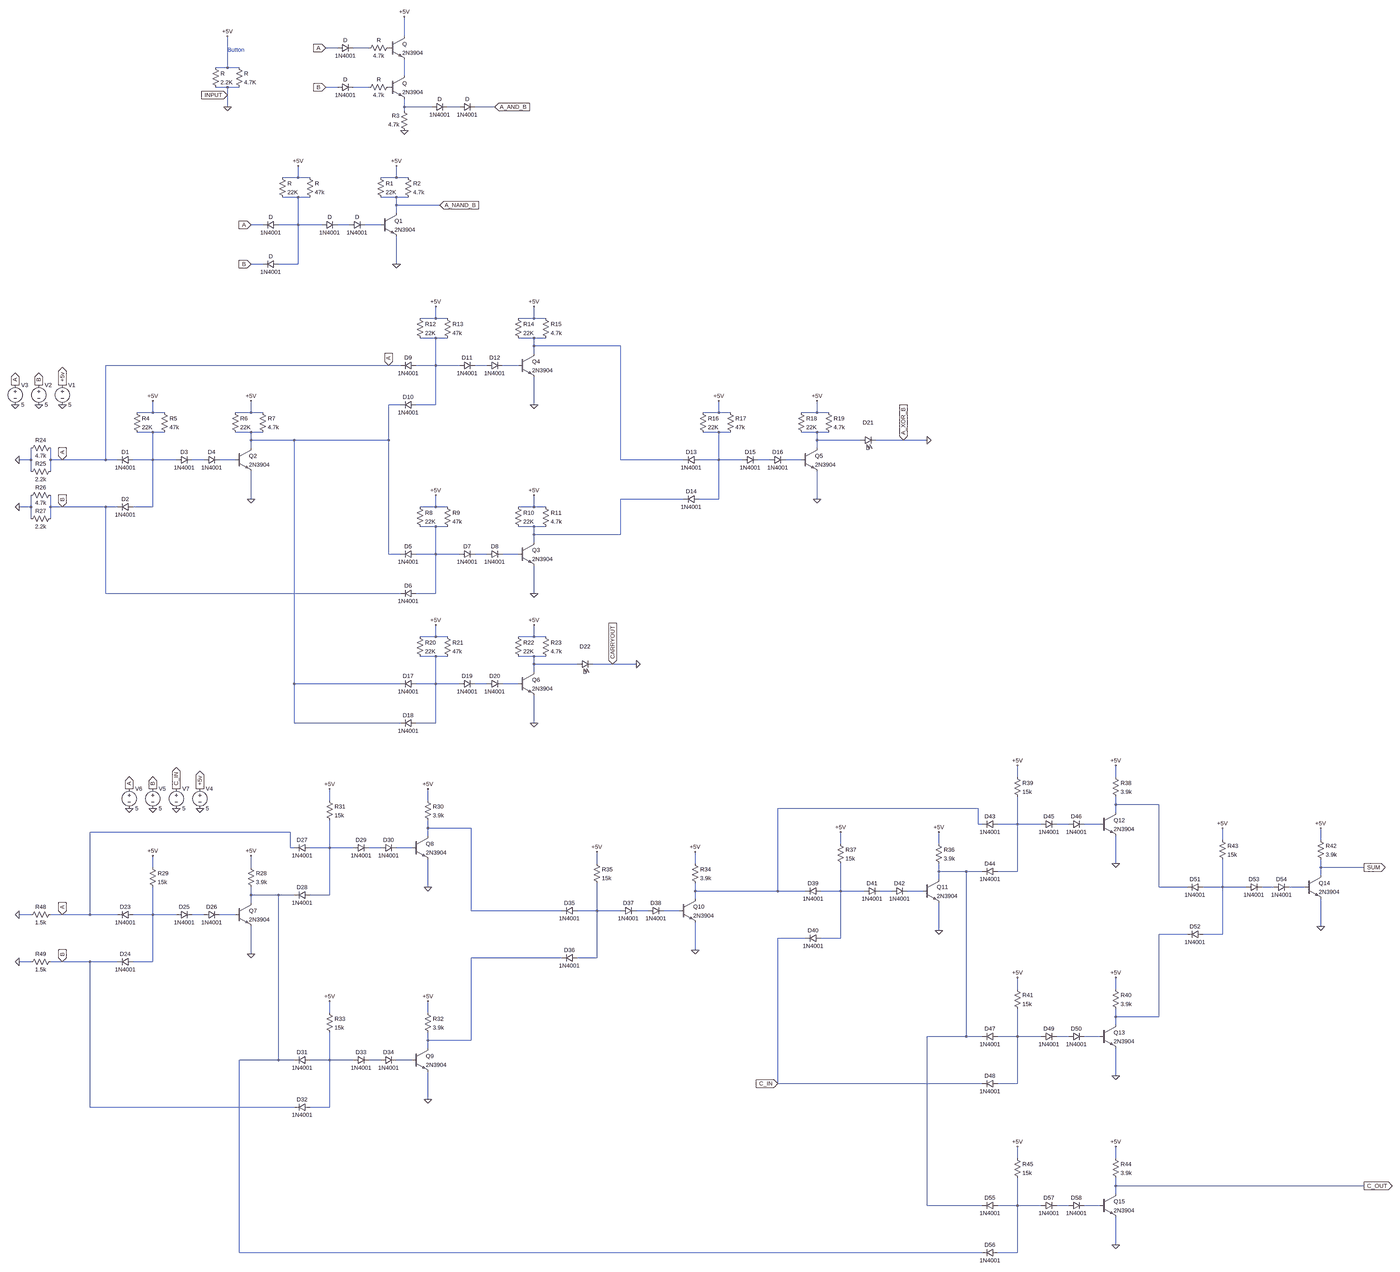
[diagram p0: schematic Project2SERRANO.asc, whole sheet]
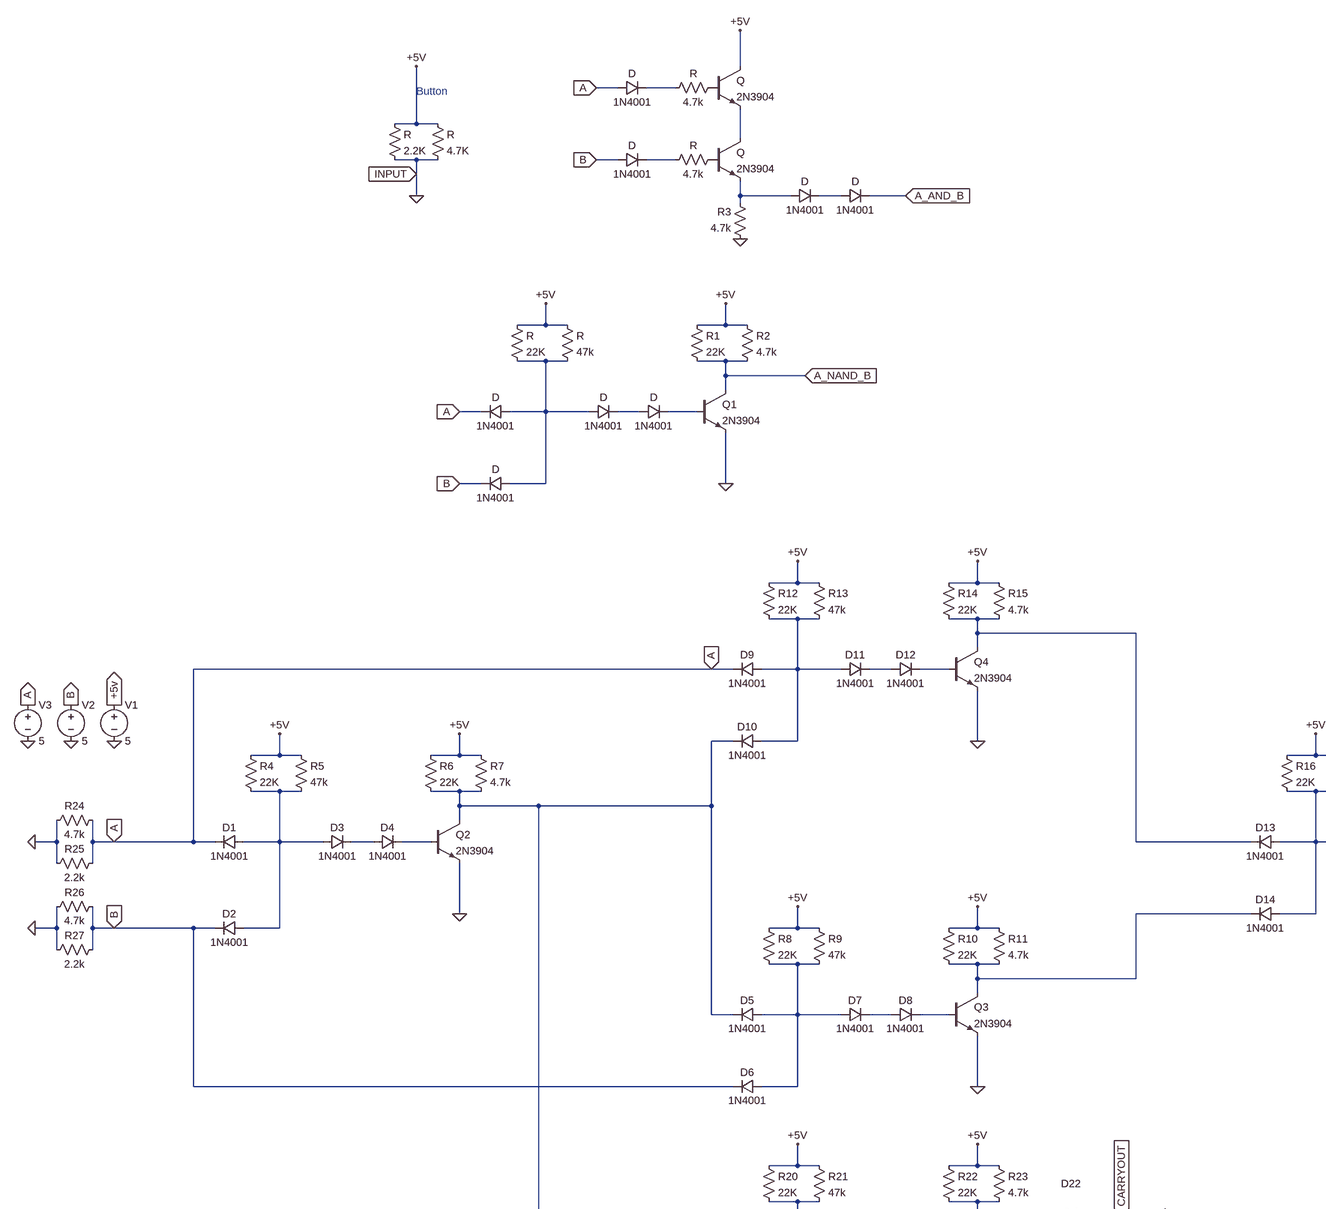
[diagram p1: schematic Project2SERRANO.asc, part, row 1 of 2, column 1 of 2]
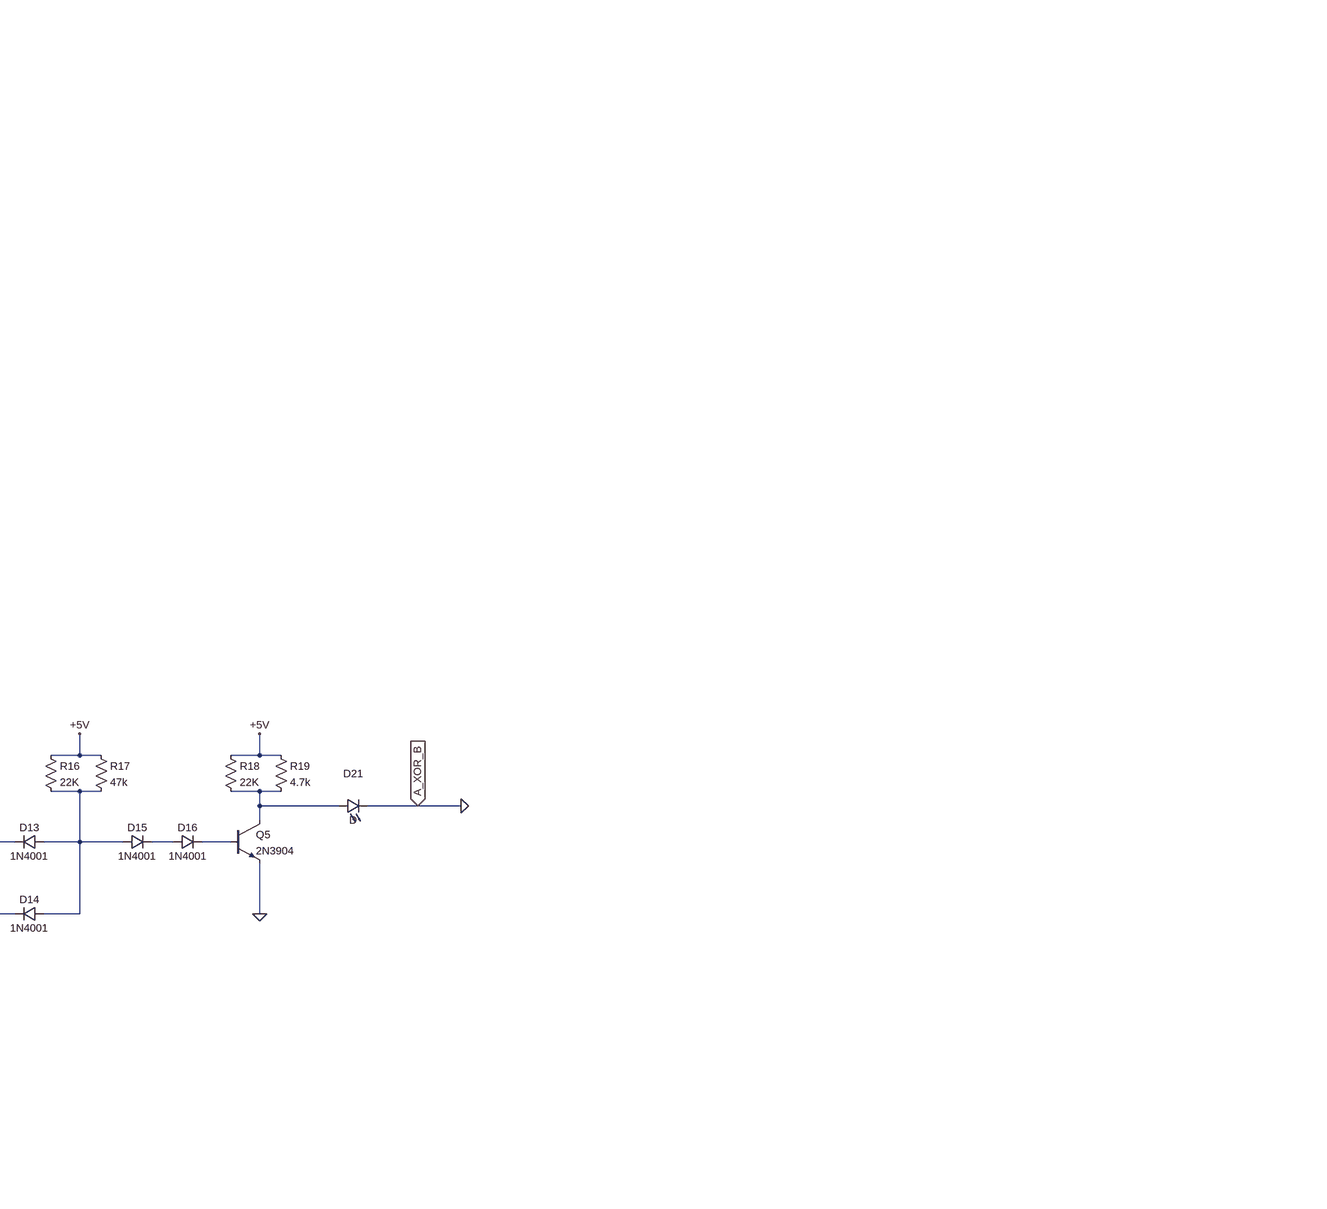
[diagram p2: schematic Project2SERRANO.asc, part, row 1 of 2, column 2 of 2]
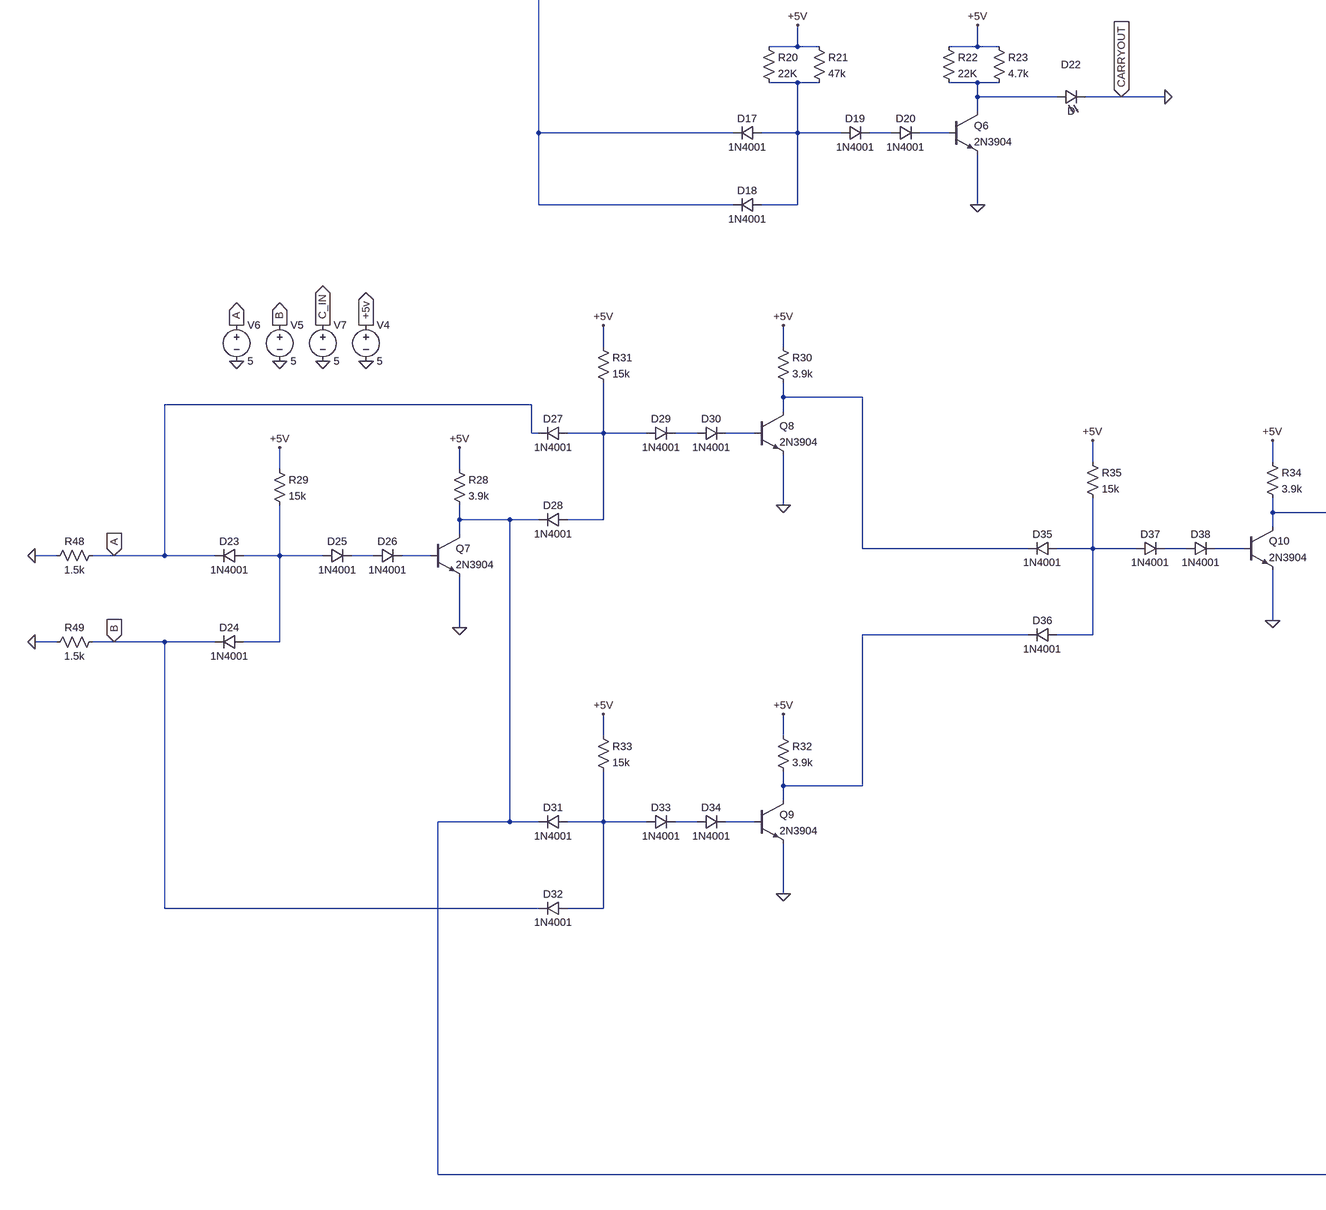
[diagram p3: schematic Project2SERRANO.asc, part, row 2 of 2, column 1 of 2]
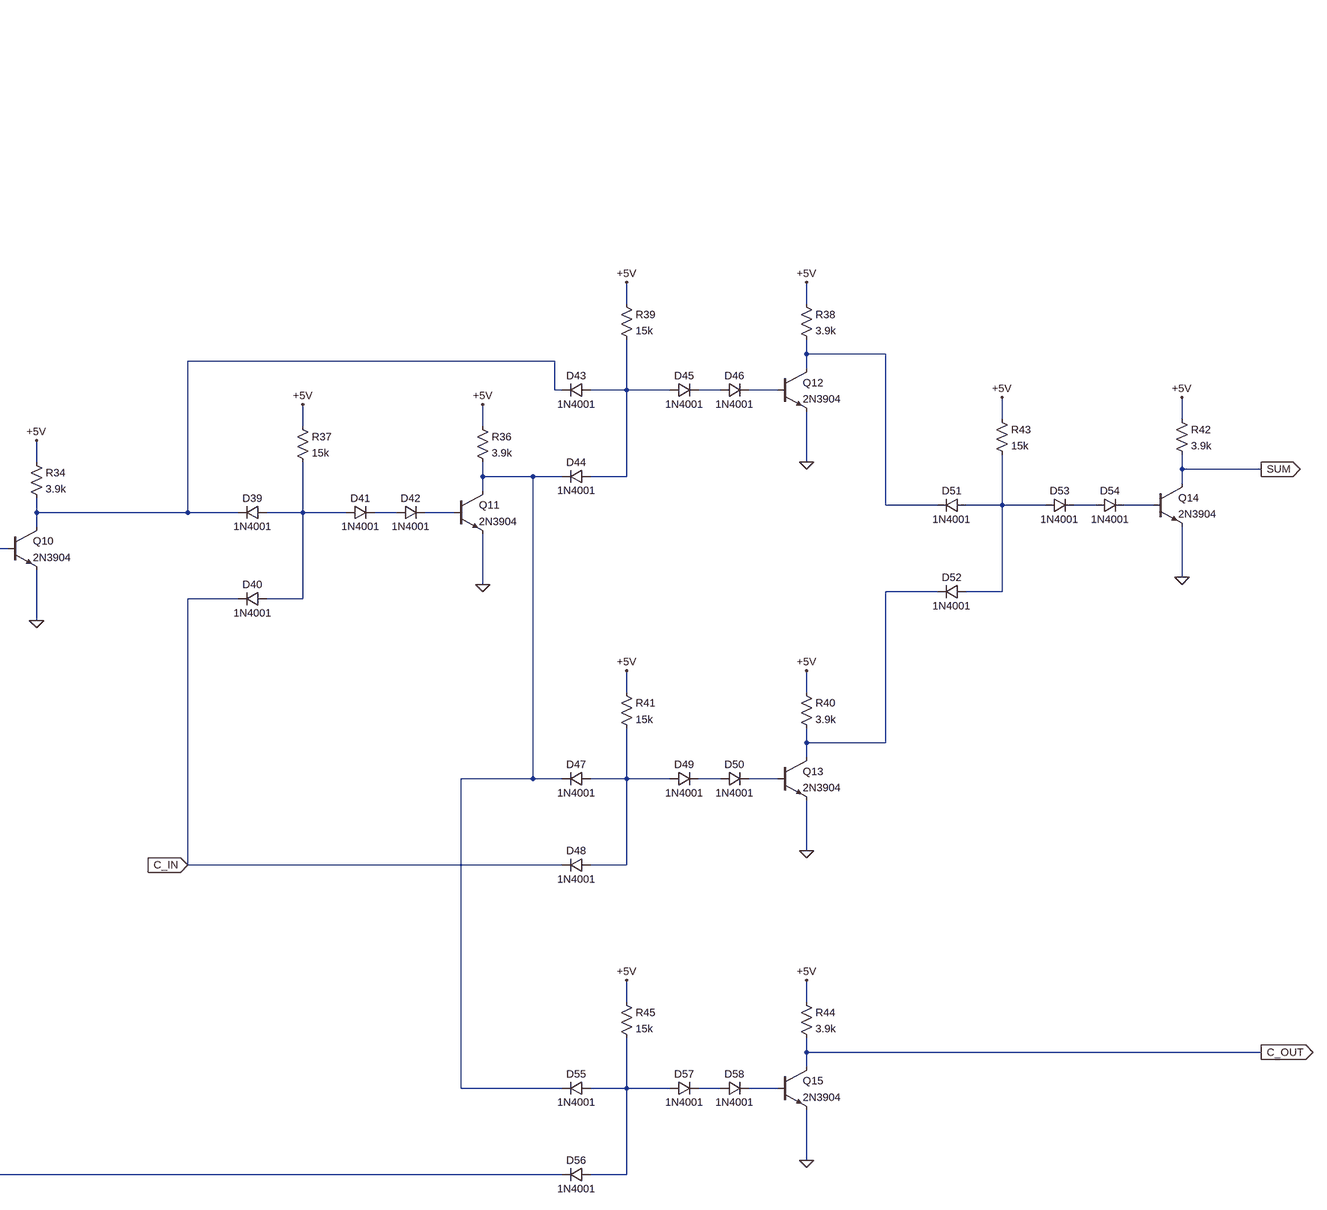
[diagram p4: schematic Project2SERRANO.asc, part, row 2 of 2, column 2 of 2]
Project2SERRANO.asc, the LTspice schematic file:
Version 4
SHEET 1 4668 5584
WIRE 368 -208 368 -288
WIRE 96 -160 48 -160
WIRE 224 -160 160 -160
WIRE -352 -80 -352 -208
WIRE -352 -80 -400 -80
WIRE -304 -80 -352 -80
WIRE 368 -48 368 -112
WIRE -352 0 -400 0
WIRE -304 0 -352 0
WIRE 96 0 48 0
WIRE 224 0 160 0
WIRE -352 32 -352 0
WIRE -352 80 -352 32
WIRE 368 80 368 48
WIRE 480 80 368 80
WIRE 592 80 544 80
WIRE 736 80 656 80
WIRE 368 96 368 80
WIRE -64 368 -64 320
WIRE -64 368 -128 368
WIRE -16 368 -64 368
WIRE 336 368 336 320
WIRE 336 368 272 368
WIRE 384 368 336 368
WIRE -64 448 -128 448
WIRE -16 448 -64 448
WIRE 336 448 272 448
WIRE 384 448 336 448
WIRE 336 480 336 448
WIRE 512 480 336 480
WIRE 336 512 336 480
WIRE -208 560 -256 560
WIRE -64 560 -64 448
WIRE -64 560 -144 560
WIRE 32 560 -64 560
WIRE 144 560 96 560
WIRE 272 560 208 560
WIRE -208 720 -256 720
WIRE -64 720 -64 560
WIRE -64 720 -144 720
WIRE 336 720 336 608
WIRE 496 1344 496 1296
WIRE 496 1344 432 1344
WIRE 544 1344 496 1344
WIRE 896 1344 896 1296
WIRE 896 1344 832 1344
WIRE 944 1344 896 1344
WIRE 496 1424 432 1424
WIRE 544 1424 496 1424
WIRE 896 1424 832 1424
WIRE 944 1424 896 1424
WIRE 896 1456 896 1424
WIRE 1248 1456 896 1456
WIRE 896 1488 896 1456
WIRE 304 1536 -848 1536
WIRE 352 1536 304 1536
WIRE 496 1536 496 1424
WIRE 496 1536 416 1536
WIRE 592 1536 496 1536
WIRE 704 1536 656 1536
WIRE 832 1536 768 1536
WIRE 352 1696 304 1696
WIRE 496 1696 496 1536
WIRE 496 1696 416 1696
WIRE 896 1696 896 1584
WIRE -656 1728 -656 1680
WIRE -656 1728 -720 1728
WIRE -608 1728 -656 1728
WIRE -256 1728 -256 1680
WIRE -256 1728 -320 1728
WIRE -208 1728 -256 1728
WIRE 1648 1728 1648 1680
WIRE 1648 1728 1584 1728
WIRE 1696 1728 1648 1728
WIRE 2048 1728 2048 1680
WIRE 2048 1728 1984 1728
WIRE 2096 1728 2048 1728
WIRE -656 1808 -720 1808
WIRE -608 1808 -656 1808
WIRE -256 1808 -320 1808
WIRE -208 1808 -256 1808
WIRE 1648 1808 1584 1808
WIRE 1696 1808 1648 1808
WIRE 2048 1808 1984 1808
WIRE 2096 1808 2048 1808
WIRE -256 1840 -256 1808
WIRE -80 1840 -256 1840
WIRE 304 1840 304 1696
WIRE 304 1840 -80 1840
WIRE 2048 1840 2048 1808
WIRE 2224 1840 2048 1840
WIRE 2400 1840 2288 1840
WIRE 2496 1840 2400 1840
WIRE -256 1872 -256 1840
WIRE 2048 1872 2048 1840
WIRE -1152 1920 -1152 1872
WIRE -1152 1920 -1200 1920
WIRE -1072 1920 -1072 1872
WIRE -1024 1920 -1072 1920
WIRE -848 1920 -848 1536
WIRE -848 1920 -1024 1920
WIRE -800 1920 -848 1920
WIRE -656 1920 -656 1808
WIRE -656 1920 -736 1920
WIRE -560 1920 -656 1920
WIRE -448 1920 -496 1920
WIRE -320 1920 -384 1920
WIRE 1248 1920 1248 1456
WIRE 1504 1920 1248 1920
WIRE 1648 1920 1648 1808
WIRE 1648 1920 1568 1920
WIRE 1744 1920 1648 1920
WIRE 1856 1920 1808 1920
WIRE 1984 1920 1920 1920
WIRE -1152 1968 -1152 1920
WIRE -1072 1968 -1072 1920
WIRE -256 2080 -256 1968
WIRE 1504 2080 1248 2080
WIRE 1648 2080 1648 1920
WIRE 1648 2080 1568 2080
WIRE 2048 2080 2048 1968
WIRE -1152 2112 -1152 2064
WIRE -1152 2112 -1200 2112
WIRE -1072 2112 -1072 2064
WIRE -1024 2112 -1072 2112
WIRE -848 2112 -1024 2112
WIRE -800 2112 -848 2112
WIRE -656 2112 -656 1920
WIRE -656 2112 -736 2112
WIRE 496 2112 496 2064
WIRE 496 2112 432 2112
WIRE 544 2112 496 2112
WIRE 896 2112 896 2064
WIRE 896 2112 832 2112
WIRE 944 2112 896 2112
WIRE -1152 2160 -1152 2112
WIRE -1072 2160 -1072 2112
WIRE 496 2192 432 2192
WIRE 544 2192 496 2192
WIRE 896 2192 832 2192
WIRE 944 2192 896 2192
WIRE 896 2224 896 2192
WIRE 1248 2224 1248 2080
WIRE 1248 2224 896 2224
WIRE 896 2256 896 2224
WIRE 304 2304 304 1840
WIRE 352 2304 304 2304
WIRE 496 2304 496 2192
WIRE 496 2304 416 2304
WIRE 592 2304 496 2304
WIRE 704 2304 656 2304
WIRE 832 2304 768 2304
WIRE -848 2464 -848 2112
WIRE 352 2464 -848 2464
WIRE 496 2464 496 2304
WIRE 496 2464 416 2464
WIRE 896 2464 896 2352
WIRE 496 2640 496 2592
WIRE 496 2640 432 2640
WIRE 544 2640 496 2640
WIRE 896 2640 896 2592
WIRE 896 2640 832 2640
WIRE 944 2640 896 2640
WIRE 496 2720 432 2720
WIRE 544 2720 496 2720
WIRE 896 2720 832 2720
WIRE 944 2720 896 2720
WIRE 896 2752 896 2720
WIRE 1072 2752 896 2752
WIRE 1216 2752 1136 2752
WIRE 1312 2752 1216 2752
WIRE 896 2784 896 2752
WIRE -80 2832 -80 1840
WIRE 352 2832 -80 2832
WIRE 496 2832 496 2720
WIRE 496 2832 416 2832
WIRE 592 2832 496 2832
WIRE 704 2832 656 2832
WIRE 832 2832 768 2832
WIRE -80 2992 -80 2832
WIRE 352 2992 -80 2992
WIRE 496 2992 496 2832
WIRE 496 2992 416 2992
WIRE 896 2992 896 2880
WIRE 2864 3600 2864 3552
WIRE 3264 3600 3264 3552
WIRE 64 3696 64 3648
WIRE 464 3696 464 3648
WIRE 3264 3712 3264 3680
WIRE 3440 3712 3264 3712
WIRE 2704 3728 1888 3728
WIRE 3264 3744 3264 3712
WIRE 2704 3792 2704 3728
WIRE 2720 3792 2704 3792
WIRE 2864 3792 2864 3680
WIRE 2864 3792 2784 3792
WIRE 2960 3792 2864 3792
WIRE 3072 3792 3024 3792
WIRE 3200 3792 3136 3792
WIRE 464 3808 464 3776
WIRE 640 3808 464 3808
WIRE -96 3824 -912 3824
WIRE 464 3840 464 3808
WIRE 3952 3856 3952 3808
WIRE 4352 3856 4352 3808
WIRE 2144 3872 2144 3824
WIRE 2544 3872 2544 3824
WIRE -96 3888 -96 3824
WIRE -80 3888 -96 3888
WIRE 64 3888 64 3776
WIRE 64 3888 -16 3888
WIRE 160 3888 64 3888
WIRE 272 3888 224 3888
WIRE 400 3888 336 3888
WIRE 1152 3952 1152 3904
WIRE 1552 3952 1552 3904
WIRE 3264 3952 3264 3840
WIRE -656 3968 -656 3920
WIRE -256 3968 -256 3920
WIRE 4352 3968 4352 3936
WIRE 4528 3968 4352 3968
WIRE 2544 3984 2544 3952
WIRE 2656 3984 2544 3984
WIRE 2720 3984 2656 3984
WIRE 2864 3984 2864 3792
WIRE 2864 3984 2784 3984
WIRE 4352 4000 4352 3968
WIRE 2544 4016 2544 3984
WIRE 464 4048 464 3936
WIRE 3440 4048 3440 3712
WIRE 3808 4048 3440 4048
WIRE 3952 4048 3952 3936
WIRE 3952 4048 3872 4048
WIRE 4048 4048 3952 4048
WIRE 4160 4048 4112 4048
WIRE 4288 4048 4224 4048
WIRE 1552 4064 1552 4032
WIRE 1888 4064 1888 3728
WIRE 1888 4064 1552 4064
WIRE 2000 4064 1888 4064
WIRE 2144 4064 2144 3952
WIRE 2144 4064 2064 4064
WIRE 2240 4064 2144 4064
WIRE 2352 4064 2304 4064
WIRE 2480 4064 2416 4064
WIRE -256 4080 -256 4048
WIRE -144 4080 -256 4080
WIRE -80 4080 -144 4080
WIRE 64 4080 64 3888
WIRE 64 4080 -16 4080
WIRE 1552 4096 1552 4064
WIRE -256 4112 -256 4080
WIRE 640 4144 640 3808
WIRE 1008 4144 640 4144
WIRE 1152 4144 1152 4032
WIRE 1152 4144 1072 4144
WIRE 1248 4144 1152 4144
WIRE 1360 4144 1312 4144
WIRE 1488 4144 1424 4144
WIRE -1152 4160 -1200 4160
WIRE -1024 4160 -1072 4160
WIRE -912 4160 -912 3824
WIRE -912 4160 -1024 4160
WIRE -800 4160 -912 4160
WIRE -656 4160 -656 4048
WIRE -656 4160 -736 4160
WIRE -560 4160 -656 4160
WIRE -448 4160 -496 4160
WIRE -320 4160 -384 4160
WIRE 4352 4208 4352 4096
WIRE 2544 4224 2544 4112
WIRE 3808 4240 3440 4240
WIRE 3952 4240 3952 4048
WIRE 3952 4240 3872 4240
WIRE 2000 4256 1888 4256
WIRE 2144 4256 2144 4064
WIRE 2144 4256 2064 4256
WIRE 1552 4304 1552 4192
WIRE -256 4320 -256 4208
WIRE 1008 4336 640 4336
WIRE 1152 4336 1152 4144
WIRE 1152 4336 1072 4336
WIRE -1152 4352 -1200 4352
WIRE -1024 4352 -1072 4352
WIRE -912 4352 -1024 4352
WIRE -800 4352 -912 4352
WIRE -656 4352 -656 4160
WIRE -656 4352 -736 4352
WIRE 2864 4464 2864 4416
WIRE 3264 4464 3264 4416
WIRE 64 4560 64 4512
WIRE 464 4560 464 4512
WIRE 3264 4576 3264 4544
WIRE 3440 4576 3440 4240
WIRE 3440 4576 3264 4576
WIRE 3264 4608 3264 4576
WIRE 2656 4656 2656 3984
WIRE 2656 4656 2496 4656
WIRE 2720 4656 2656 4656
WIRE 2864 4656 2864 4544
WIRE 2864 4656 2784 4656
WIRE 2960 4656 2864 4656
WIRE 3072 4656 3024 4656
WIRE 3200 4656 3136 4656
WIRE 464 4672 464 4640
WIRE 640 4672 640 4336
WIRE 640 4672 464 4672
WIRE 464 4704 464 4672
WIRE -144 4752 -144 4080
WIRE -144 4752 -304 4752
WIRE -80 4752 -144 4752
WIRE 64 4752 64 4640
WIRE 64 4752 -16 4752
WIRE 160 4752 64 4752
WIRE 272 4752 224 4752
WIRE 400 4752 336 4752
WIRE 3264 4816 3264 4704
WIRE 1888 4848 1888 4256
WIRE 2720 4848 1888 4848
WIRE 2864 4848 2864 4656
WIRE 2864 4848 2784 4848
WIRE 464 4912 464 4800
WIRE -912 4944 -912 4352
WIRE -80 4944 -912 4944
WIRE 64 4944 64 4752
WIRE 64 4944 -16 4944
WIRE 2864 5152 2864 5104
WIRE 3264 5152 3264 5104
WIRE 3264 5264 3264 5232
WIRE 4528 5264 3264 5264
WIRE 3264 5296 3264 5264
WIRE 2496 5344 2496 4656
WIRE 2720 5344 2496 5344
WIRE 2864 5344 2864 5232
WIRE 2864 5344 2784 5344
WIRE 2960 5344 2864 5344
WIRE 3072 5344 3024 5344
WIRE 3200 5344 3136 5344
WIRE 3264 5504 3264 5392
WIRE -304 5536 -304 4752
WIRE 2720 5536 -304 5536
WIRE 2864 5536 2864 5344
WIRE 2864 5536 2784 5536
FLAG 48 0 B
IOPIN 48 0 In
FLAG 48 -160 A
IOPIN 48 -160 In
FLAG 736 80 A_AND_B
IOPIN 736 80 In
FLAG 368 -288 +5V
FLAG 368 176 0
FLAG -352 -208 +5V
FLAG -352 80 0
FLAG -352 32 INPUT
IOPIN -352 32 In
FLAG -256 720 B
IOPIN -256 720 In
FLAG -256 560 A
IOPIN -256 560 In
FLAG -64 320 +5V
FLAG 336 320 +5V
FLAG 336 720 0
FLAG 512 480 A_NAND_B
IOPIN 512 480 In
FLAG -656 1680 +5V
FLAG -256 1680 +5V
FLAG -256 2080 0
FLAG 496 2064 +5V
FLAG 896 2064 +5V
FLAG 896 2464 0
FLAG 304 1536 A
IOPIN 304 1536 In
FLAG 496 1296 +5V
FLAG 896 1296 +5V
FLAG 896 1696 0
FLAG 1648 1680 +5V
FLAG 2048 1680 +5V
FLAG 2048 2080 0
FLAG 2400 1840 A_XOR_B
IOPIN 2400 1840 In
FLAG 496 2592 +5V
FLAG 896 2592 +5V
FLAG 896 2992 0
FLAG 1216 2752 CARRYOUT
IOPIN 1216 2752 In
FLAG 2496 1840 0
FLAG 1312 2752 0
FLAG -1024 1920 A
IOPIN -1024 1920 In
FLAG -1024 2112 B
IOPIN -1024 2112 In
FLAG -1200 1920 0
FLAG -1200 2112 0
FLAG -1024 1696 0
FLAG -1024 1616 +5v
IOPIN -1024 1616 Out
FLAG -1120 1696 0
FLAG -1120 1616 B
IOPIN -1120 1616 Out
FLAG -1216 1696 0
FLAG -1216 1616 A
IOPIN -1216 1616 Out
FLAG -656 3920 +5V
FLAG -256 3920 +5V
FLAG -256 4320 0
FLAG -1024 4160 A
IOPIN -1024 4160 In
FLAG -1024 4352 B
IOPIN -1024 4352 In
FLAG -1200 4160 0
FLAG -1200 4352 0
FLAG -464 3728 0
FLAG -464 3648 +5v
IOPIN -464 3648 Out
FLAG -656 3728 0
FLAG -656 3648 B
IOPIN -656 3648 Out
FLAG -752 3728 0
FLAG -752 3648 A
IOPIN -752 3648 Out
FLAG 64 3648 +5V
FLAG 464 3648 +5V
FLAG 464 4048 0
FLAG 64 4512 +5V
FLAG 464 4512 +5V
FLAG 464 4912 0
FLAG 1152 3904 +5V
FLAG 1552 3904 +5V
FLAG 1552 4304 0
FLAG 2144 3824 +5V
FLAG 2544 3824 +5V
FLAG 2544 4224 0
FLAG 2864 3552 +5V
FLAG 3264 3552 +5V
FLAG 3264 3952 0
FLAG 2864 4416 +5V
FLAG 3264 4416 +5V
FLAG 3264 4816 0
FLAG 3952 3808 +5V
FLAG 4352 3808 +5V
FLAG 4352 4208 0
FLAG 1888 4848 C_IN
IOPIN 1888 4848 In
FLAG 4528 3968 SUM
IOPIN 4528 3968 Out
FLAG 2864 5104 +5V
FLAG 3264 5104 +5V
FLAG 3264 5504 0
FLAG 4528 5264 C_OUT
IOPIN 4528 5264 Out
FLAG -560 3728 0
FLAG -560 3648 C_IN
IOPIN -560 3648 Out
SYMBOL diode 96 -144 R270
WINDOW 0 32 32 VTop 2
WINDOW 3 0 32 VBottom 2
SYMATTR InstName D
SYMATTR Value 1N4001
SYMBOL diode 96 16 R270
WINDOW 0 32 32 VTop 2
WINDOW 3 0 32 VBottom 2
SYMATTR InstName D
SYMATTR Value 1N4001
SYMBOL npn 304 -208 R0
SYMATTR InstName Q
SYMATTR Value 2N3904
SYMBOL res 208 16 R270
WINDOW 0 32 56 VTop 2
WINDOW 3 0 56 VBottom 2
SYMATTR InstName R
SYMATTR Value 4.7k
SYMBOL res 208 -144 R270
WINDOW 0 32 56 VTop 2
WINDOW 3 0 56 VBottom 2
SYMATTR InstName R
SYMATTR Value 4.7k
SYMBOL npn 304 -48 R0
SYMATTR InstName Q
SYMATTR Value 2N3904
SYMBOL res 384 192 R180
WINDOW 0 36 76 Left 2
WINDOW 3 36 40 Left 2
SYMATTR InstName R3
SYMATTR Value 4.7k
SYMBOL diode 480 96 R270
WINDOW 0 32 32 VTop 2
WINDOW 3 0 32 VBottom 2
SYMATTR InstName D
SYMATTR Value 1N4001
SYMBOL diode 592 96 R270
WINDOW 0 32 32 VTop 2
WINDOW 3 0 32 VBottom 2
SYMATTR InstName D
SYMATTR Value 1N4001
SYMBOL res -320 -96 R0
SYMATTR InstName R
SYMATTR Value 4.7K
SYMBOL res -416 -96 R0
SYMATTR InstName R
SYMATTR Value 2.2K
SYMBOL diode -144 544 R90
WINDOW 0 0 32 VBottom 2
WINDOW 3 32 32 VTop 2
SYMATTR InstName D
SYMATTR Value 1N4001
SYMBOL diode -144 704 R90
WINDOW 0 0 32 VBottom 2
WINDOW 3 32 32 VTop 2
SYMATTR InstName D
SYMATTR Value 1N4001
SYMBOL res -144 352 R0
SYMATTR InstName R
SYMATTR Value 22K
SYMBOL res -32 352 R0
SYMATTR InstName R
SYMATTR Value 47k
SYMBOL diode 32 576 R270
WINDOW 0 32 32 VTop 2
WINDOW 3 0 32 VBottom 2
SYMATTR InstName D
SYMATTR Value 1N4001
SYMBOL diode 144 576 R270
WINDOW 0 32 32 VTop 2
WINDOW 3 0 32 VBottom 2
SYMATTR InstName D
SYMATTR Value 1N4001
SYMBOL npn 272 512 R0
SYMATTR InstName Q1
SYMATTR Value 2N3904
SYMBOL res 256 352 R0
SYMATTR InstName R1
SYMATTR Value 22K
SYMBOL res 368 352 R0
SYMATTR InstName R2
SYMATTR Value 4.7k
SYMBOL diode -736 1904 R90
WINDOW 0 0 32 VBottom 2
WINDOW 3 32 32 VTop 2
SYMATTR InstName D1
SYMATTR Value 1N4001
SYMBOL diode -736 2096 R90
WINDOW 0 0 32 VBottom 2
WINDOW 3 32 32 VTop 2
SYMATTR InstName D2
SYMATTR Value 1N4001
SYMBOL res -736 1712 R0
SYMATTR InstName R4
SYMATTR Value 22K
SYMBOL res -624 1712 R0
SYMATTR InstName R5
SYMATTR Value 47k
SYMBOL diode -560 1936 R270
WINDOW 0 32 32 VTop 2
WINDOW 3 0 32 VBottom 2
SYMATTR InstName D3
SYMATTR Value 1N4001
SYMBOL diode -448 1936 R270
WINDOW 0 32 32 VTop 2
WINDOW 3 0 32 VBottom 2
SYMATTR InstName D4
SYMATTR Value 1N4001
SYMBOL npn -320 1872 R0
SYMATTR InstName Q2
SYMATTR Value 2N3904
SYMBOL res -336 1712 R0
SYMATTR InstName R6
SYMATTR Value 22K
SYMBOL res -224 1712 R0
SYMATTR InstName R7
SYMATTR Value 4.7k
SYMBOL diode 416 2288 R90
WINDOW 0 0 32 VBottom 2
WINDOW 3 32 32 VTop 2
SYMATTR InstName D5
SYMATTR Value 1N4001
SYMBOL diode 416 2448 R90
WINDOW 0 0 32 VBottom 2
WINDOW 3 32 32 VTop 2
SYMATTR InstName D6
SYMATTR Value 1N4001
SYMBOL res 416 2096 R0
SYMATTR InstName R8
SYMATTR Value 22K
SYMBOL res 528 2096 R0
SYMATTR InstName R9
SYMATTR Value 47k
SYMBOL diode 592 2320 R270
WINDOW 0 32 32 VTop 2
WINDOW 3 0 32 VBottom 2
SYMATTR InstName D7
SYMATTR Value 1N4001
SYMBOL diode 704 2320 R270
WINDOW 0 32 32 VTop 2
WINDOW 3 0 32 VBottom 2
SYMATTR InstName D8
SYMATTR Value 1N4001
SYMBOL npn 832 2256 R0
SYMATTR InstName Q3
SYMATTR Value 2N3904
SYMBOL res 816 2096 R0
SYMATTR InstName R10
SYMATTR Value 22K
SYMBOL res 928 2096 R0
SYMATTR InstName R11
SYMATTR Value 4.7k
SYMBOL diode 416 1520 R90
WINDOW 0 0 32 VBottom 2
WINDOW 3 32 32 VTop 2
SYMATTR InstName D9
SYMATTR Value 1N4001
SYMBOL diode 416 1680 R90
WINDOW 0 0 32 VBottom 2
WINDOW 3 32 32 VTop 2
SYMATTR InstName D10
SYMATTR Value 1N4001
SYMBOL res 416 1328 R0
SYMATTR InstName R12
SYMATTR Value 22K
SYMBOL res 528 1328 R0
SYMATTR InstName R13
SYMATTR Value 47k
SYMBOL diode 592 1552 R270
WINDOW 0 32 32 VTop 2
WINDOW 3 0 32 VBottom 2
SYMATTR InstName D11
SYMATTR Value 1N4001
SYMBOL diode 704 1552 R270
WINDOW 0 32 32 VTop 2
WINDOW 3 0 32 VBottom 2
SYMATTR InstName D12
SYMATTR Value 1N4001
SYMBOL npn 832 1488 R0
SYMATTR InstName Q4
SYMATTR Value 2N3904
SYMBOL res 816 1328 R0
SYMATTR InstName R14
SYMATTR Value 22K
SYMBOL res 928 1328 R0
SYMATTR InstName R15
SYMATTR Value 4.7k
SYMBOL diode 1568 1904 R90
WINDOW 0 0 32 VBottom 2
WINDOW 3 32 32 VTop 2
SYMATTR InstName D13
SYMATTR Value 1N4001
SYMBOL diode 1568 2064 R90
WINDOW 0 0 32 VBottom 2
WINDOW 3 32 32 VTop 2
SYMATTR InstName D14
SYMATTR Value 1N4001
SYMBOL res 1568 1712 R0
SYMATTR InstName R16
SYMATTR Value 22K
SYMBOL res 1680 1712 R0
SYMATTR InstName R17
SYMATTR Value 47k
SYMBOL diode 1744 1936 R270
WINDOW 0 32 32 VTop 2
WINDOW 3 0 32 VBottom 2
SYMATTR InstName D15
SYMATTR Value 1N4001
SYMBOL diode 1856 1936 R270
WINDOW 0 32 32 VTop 2
WINDOW 3 0 32 VBottom 2
SYMATTR InstName D16
SYMATTR Value 1N4001
SYMBOL npn 1984 1872 R0
SYMATTR InstName Q5
SYMATTR Value 2N3904
SYMBOL res 1968 1712 R0
SYMATTR InstName R18
SYMATTR Value 22K
SYMBOL res 2080 1712 R0
SYMATTR InstName R19
SYMATTR Value 4.7k
SYMBOL diode 416 2816 R90
WINDOW 0 0 32 VBottom 2
WINDOW 3 32 32 VTop 2
SYMATTR InstName D17
SYMATTR Value 1N4001
SYMBOL diode 416 2976 R90
WINDOW 0 0 32 VBottom 2
WINDOW 3 32 32 VTop 2
SYMATTR InstName D18
SYMATTR Value 1N4001
SYMBOL res 416 2624 R0
SYMATTR InstName R20
SYMATTR Value 22K
SYMBOL res 528 2624 R0
SYMATTR InstName R21
SYMATTR Value 47k
SYMBOL diode 592 2848 R270
WINDOW 0 32 32 VTop 2
WINDOW 3 0 32 VBottom 2
SYMATTR InstName D19
SYMATTR Value 1N4001
SYMBOL diode 704 2848 R270
WINDOW 0 32 32 VTop 2
WINDOW 3 0 32 VBottom 2
SYMATTR InstName D20
SYMATTR Value 1N4001
SYMBOL npn 832 2784 R0
SYMATTR InstName Q6
SYMATTR Value 2N3904
SYMBOL res 816 2624 R0
SYMATTR InstName R22
SYMATTR Value 22K
SYMBOL res 928 2624 R0
SYMATTR InstName R23
SYMATTR Value 4.7k
SYMBOL LED 2224 1856 R270
WINDOW 0 72 32 VTop 2
WINDOW 3 0 32 VBottom 2
SYMATTR InstName D21
SYMBOL LED 1072 2768 R270
WINDOW 0 72 32 VTop 2
WINDOW 3 0 32 VBottom 2
SYMATTR InstName D22
SYMBOL res -1056 1856 R90
WINDOW 0 0 56 VBottom 2
WINDOW 3 32 56 VTop 2
SYMATTR InstName R24
SYMATTR Value 4.7k
SYMBOL res -1056 1952 R90
WINDOW 0 0 56 VBottom 2
WINDOW 3 32 56 VTop 2
SYMATTR InstName R25
SYMATTR Value 2.2k
SYMBOL res -1056 2048 R90
WINDOW 0 0 56 VBottom 2
WINDOW 3 32 56 VTop 2
SYMATTR InstName R26
SYMATTR Value 4.7k
SYMBOL res -1056 2144 R90
WINDOW 0 0 56 VBottom 2
WINDOW 3 32 56 VTop 2
SYMATTR InstName R27
SYMATTR Value 2.2k
SYMBOL voltage -1024 1600 R0
WINDOW 123 0 0 Left 0
WINDOW 39 0 0 Left 0
SYMATTR InstName V1
SYMATTR Value 5
SYMBOL voltage -1120 1600 R0
WINDOW 123 0 0 Left 0
WINDOW 39 0 0 Left 0
SYMATTR InstName V2
SYMATTR Value 5
SYMBOL voltage -1216 1600 R0
WINDOW 123 0 0 Left 0
WINDOW 39 0 0 Left 0
SYMATTR InstName V3
SYMATTR Value 5
SYMBOL diode -736 4144 R90
WINDOW 0 0 32 VBottom 2
WINDOW 3 32 32 VTop 2
SYMATTR InstName D23
SYMATTR Value 1N4001
SYMBOL diode -736 4336 R90
WINDOW 0 0 32 VBottom 2
WINDOW 3 32 32 VTop 2
SYMATTR InstName D24
SYMATTR Value 1N4001
SYMBOL diode -560 4176 R270
WINDOW 0 32 32 VTop 2
WINDOW 3 0 32 VBottom 2
SYMATTR InstName D25
SYMATTR Value 1N4001
SYMBOL diode -448 4176 R270
WINDOW 0 32 32 VTop 2
WINDOW 3 0 32 VBottom 2
SYMATTR InstName D26
SYMATTR Value 1N4001
SYMBOL npn -320 4112 R0
SYMATTR InstName Q7
SYMATTR Value 2N3904
SYMBOL voltage -464 3632 R0
WINDOW 123 0 0 Left 0
WINDOW 39 0 0 Left 0
SYMATTR InstName V4
SYMATTR Value 5
SYMBOL voltage -656 3632 R0
WINDOW 123 0 0 Left 0
WINDOW 39 0 0 Left 0
SYMATTR InstName V5
SYMATTR Value 5
SYMBOL voltage -752 3632 R0
WINDOW 123 0 0 Left 0
WINDOW 39 0 0 Left 0
SYMATTR InstName V6
SYMATTR Value 5
SYMBOL res -1056 4144 R90
WINDOW 0 0 56 VBottom 2
WINDOW 3 32 56 VTop 2
SYMATTR InstName R48
SYMATTR Value 1.5k
SYMBOL res -1056 4336 R90
WINDOW 0 0 56 VBottom 2
WINDOW 3 32 56 VTop 2
SYMATTR InstName R49
SYMATTR Value 1.5k
SYMBOL res -272 3952 R0
SYMATTR InstName R28
SYMATTR Value 3.9k
SYMBOL res -672 3952 R0
SYMATTR InstName R29
SYMATTR Value 15k
SYMBOL diode -16 3872 R90
WINDOW 0 0 32 VBottom 2
WINDOW 3 32 32 VTop 2
SYMATTR InstName D27
SYMATTR Value 1N4001
SYMBOL diode -16 4064 R90
WINDOW 0 0 32 VBottom 2
WINDOW 3 32 32 VTop 2
SYMATTR InstName D28
SYMATTR Value 1N4001
SYMBOL diode 160 3904 R270
WINDOW 0 32 32 VTop 2
WINDOW 3 0 32 VBottom 2
SYMATTR InstName D29
SYMATTR Value 1N4001
SYMBOL diode 272 3904 R270
WINDOW 0 32 32 VTop 2
WINDOW 3 0 32 VBottom 2
SYMATTR InstName D30
SYMATTR Value 1N4001
SYMBOL npn 400 3840 R0
SYMATTR InstName Q8
SYMATTR Value 2N3904
SYMBOL res 448 3680 R0
SYMATTR InstName R30
SYMATTR Value 3.9k
SYMBOL res 48 3680 R0
SYMATTR InstName R31
SYMATTR Value 15k
SYMBOL diode -16 4736 R90
WINDOW 0 0 32 VBottom 2
WINDOW 3 32 32 VTop 2
SYMATTR InstName D31
SYMATTR Value 1N4001
SYMBOL diode -16 4928 R90
WINDOW 0 0 32 VBottom 2
WINDOW 3 32 32 VTop 2
SYMATTR InstName D32
SYMATTR Value 1N4001
SYMBOL diode 160 4768 R270
WINDOW 0 32 32 VTop 2
WINDOW 3 0 32 VBottom 2
SYMATTR InstName D33
SYMATTR Value 1N4001
SYMBOL diode 272 4768 R270
WINDOW 0 32 32 VTop 2
WINDOW 3 0 32 VBottom 2
SYMATTR InstName D34
SYMATTR Value 1N4001
SYMBOL npn 400 4704 R0
SYMATTR InstName Q9
SYMATTR Value 2N3904
SYMBOL res 448 4544 R0
SYMATTR InstName R32
SYMATTR Value 3.9k
SYMBOL res 48 4544 R0
SYMATTR InstName R33
SYMATTR Value 15k
SYMBOL diode 1072 4128 R90
WINDOW 0 0 32 VBottom 2
WINDOW 3 32 32 VTop 2
SYMATTR InstName D35
SYMATTR Value 1N4001
SYMBOL diode 1072 4320 R90
WINDOW 0 0 32 VBottom 2
WINDOW 3 32 32 VTop 2
SYMATTR InstName D36
SYMATTR Value 1N4001
SYMBOL diode 1248 4160 R270
WINDOW 0 32 32 VTop 2
WINDOW 3 0 32 VBottom 2
SYMATTR InstName D37
SYMATTR Value 1N4001
SYMBOL diode 1360 4160 R270
WINDOW 0 32 32 VTop 2
WINDOW 3 0 32 VBottom 2
SYMATTR InstName D38
SYMATTR Value 1N4001
SYMBOL npn 1488 4096 R0
SYMATTR InstName Q10
SYMATTR Value 2N3904
SYMBOL res 1536 3936 R0
SYMATTR InstName R34
SYMATTR Value 3.9k
SYMBOL res 1136 3936 R0
SYMATTR InstName R35
SYMATTR Value 15k
SYMBOL diode 2064 4048 R90
WINDOW 0 0 32 VBottom 2
WINDOW 3 32 32 VTop 2
SYMATTR InstName D39
SYMATTR Value 1N4001
SYMBOL diode 2064 4240 R90
WINDOW 0 0 32 VBottom 2
WINDOW 3 32 32 VTop 2
SYMATTR InstName D40
SYMATTR Value 1N4001
SYMBOL diode 2240 4080 R270
WINDOW 0 32 32 VTop 2
WINDOW 3 0 32 VBottom 2
SYMATTR InstName D41
SYMATTR Value 1N4001
SYMBOL diode 2352 4080 R270
WINDOW 0 32 32 VTop 2
WINDOW 3 0 32 VBottom 2
SYMATTR InstName D42
SYMATTR Value 1N4001
SYMBOL npn 2480 4016 R0
SYMATTR InstName Q11
SYMATTR Value 2N3904
SYMBOL res 2528 3856 R0
SYMATTR InstName R36
SYMATTR Value 3.9k
SYMBOL res 2128 3856 R0
SYMATTR InstName R37
SYMATTR Value 15k
SYMBOL diode 2784 3776 R90
WINDOW 0 0 32 VBottom 2
WINDOW 3 32 32 VTop 2
SYMATTR InstName D43
SYMATTR Value 1N4001
SYMBOL diode 2784 3968 R90
WINDOW 0 0 32 VBottom 2
WINDOW 3 32 32 VTop 2
SYMATTR InstName D44
SYMATTR Value 1N4001
SYMBOL diode 2960 3808 R270
WINDOW 0 32 32 VTop 2
WINDOW 3 0 32 VBottom 2
SYMATTR InstName D45
SYMATTR Value 1N4001
SYMBOL diode 3072 3808 R270
WINDOW 0 32 32 VTop 2
WINDOW 3 0 32 VBottom 2
SYMATTR InstName D46
SYMATTR Value 1N4001
SYMBOL npn 3200 3744 R0
SYMATTR InstName Q12
SYMATTR Value 2N3904
SYMBOL res 3248 3584 R0
SYMATTR InstName R38
SYMATTR Value 3.9k
SYMBOL res 2848 3584 R0
SYMATTR InstName R39
SYMATTR Value 15k
SYMBOL diode 2784 4640 R90
WINDOW 0 0 32 VBottom 2
WINDOW 3 32 32 VTop 2
SYMATTR InstName D47
SYMATTR Value 1N4001
SYMBOL diode 2784 4832 R90
WINDOW 0 0 32 VBottom 2
WINDOW 3 32 32 VTop 2
SYMATTR InstName D48
SYMATTR Value 1N4001
SYMBOL diode 2960 4672 R270
WINDOW 0 32 32 VTop 2
WINDOW 3 0 32 VBottom 2
SYMATTR InstName D49
SYMATTR Value 1N4001
SYMBOL diode 3072 4672 R270
WINDOW 0 32 32 VTop 2
WINDOW 3 0 32 VBottom 2
SYMATTR InstName D50
SYMATTR Value 1N4001
SYMBOL npn 3200 4608 R0
SYMATTR InstName Q13
SYMATTR Value 2N3904
SYMBOL res 3248 4448 R0
SYMATTR InstName R40
SYMATTR Value 3.9k
SYMBOL res 2848 4448 R0
SYMATTR InstName R41
SYMATTR Value 15k
SYMBOL diode 3872 4032 R90
WINDOW 0 0 32 VBottom 2
WINDOW 3 32 32 VTop 2
SYMATTR InstName D51
SYMATTR Value 1N4001
SYMBOL diode 3872 4224 R90
WINDOW 0 0 32 VBottom 2
WINDOW 3 32 32 VTop 2
SYMATTR InstName D52
SYMATTR Value 1N4001
SYMBOL diode 4048 4064 R270
WINDOW 0 32 32 VTop 2
WINDOW 3 0 32 VBottom 2
SYMATTR InstName D53
SYMATTR Value 1N4001
SYMBOL diode 4160 4064 R270
WINDOW 0 32 32 VTop 2
WINDOW 3 0 32 VBottom 2
SYMATTR InstName D54
SYMATTR Value 1N4001
SYMBOL npn 4288 4000 R0
SYMATTR InstName Q14
SYMATTR Value 2N3904
SYMBOL res 4336 3840 R0
SYMATTR InstName R42
SYMATTR Value 3.9k
SYMBOL res 3936 3840 R0
SYMATTR InstName R43
SYMATTR Value 15k
SYMBOL diode 2784 5328 R90
WINDOW 0 0 32 VBottom 2
WINDOW 3 32 32 VTop 2
SYMATTR InstName D55
SYMATTR Value 1N4001
SYMBOL diode 2784 5520 R90
WINDOW 0 0 32 VBottom 2
WINDOW 3 32 32 VTop 2
SYMATTR InstName D56
SYMATTR Value 1N4001
SYMBOL diode 2960 5360 R270
WINDOW 0 32 32 VTop 2
WINDOW 3 0 32 VBottom 2
SYMATTR InstName D57
SYMATTR Value 1N4001
SYMBOL diode 3072 5360 R270
WINDOW 0 32 32 VTop 2
WINDOW 3 0 32 VBottom 2
SYMATTR InstName D58
SYMATTR Value 1N4001
SYMBOL npn 3200 5296 R0
SYMATTR InstName Q15
SYMATTR Value 2N3904
SYMBOL res 3248 5136 R0
SYMATTR InstName R44
SYMATTR Value 3.9k
SYMBOL res 2848 5136 R0
SYMATTR InstName R45
SYMATTR Value 15k
SYMBOL voltage -560 3632 R0
WINDOW 123 0 0 Left 0
WINDOW 39 0 0 Left 0
SYMATTR InstName V7
SYMATTR Value 5
TEXT -352 -152 Left 2 ;Button

The netlist it stands for:
* Project2SERRANO.asc
D A N001 1N4001
D B N003 1N4001
Q +5V P001 N002 0 2N3904
R N003 P002 4.7k
R N001 P001 4.7k
Q N002 P002 N004 0 2N3904
R3 0 N004 4.7k
D N004 N005 1N4001
D N005 A_AND_B 1N4001
R +5V 0 4.7K
R +5V 0 2.2K
D N006 A 1N4001
D N006 B 1N4001
R +5V N006 22K
R +5V N006 47k
D N006 N007 1N4001
D N007 N008 1N4001
Q1 A_NAND_B N008 0 0 2N3904
R1 +5V A_NAND_B 22K
R2 +5V A_NAND_B 4.7k
D1 N014 A 1N4001
D2 N014 B 1N4001
R4 +5V N014 22K
R5 +5V N014 47k
D3 N014 N017 1N4001
D4 N017 N018 1N4001
Q2 N013 N018 0 0 2N3904
R6 +5V N013 22K
R7 +5V N013 4.7k
D5 N022 N013 1N4001
D6 N022 B 1N4001
R8 +5V N022 22K
R9 +5V N022 47k
D7 N022 N023 1N4001
D8 N023 N024 1N4001
Q3 N021 N024 0 0 2N3904
R10 +5V N021 22K
R11 +5V N021 4.7k
D9 N009 A 1N4001
D10 N009 N013 1N4001
R12 +5V N009 22K
R13 +5V N009 47k
D11 N009 N011 1N4001
D12 N011 N012 1N4001
Q4 N010 N012 0 0 2N3904
R14 +5V N010 22K
R15 +5V N010 4.7k
D13 N015 N010 1N4001
D14 N015 N021 1N4001
R16 +5V N015 22K
R17 +5V N015 47k
D15 N015 N019 1N4001
D16 N019 N020 1N4001
Q5 N016 N020 0 0 2N3904
R18 +5V N016 22K
R19 +5V N016 4.7k
D17 N025 N013 1N4001
D18 N025 N013 1N4001
R20 +5V N025 22K
R21 +5V N025 47k
D19 N025 N027 1N4001
D20 N027 N028 1N4001
Q6 N026 N028 0 0 2N3904
R22 +5V N026 22K
R23 +5V N026 4.7k
D21 N016 0 D
D22 N026 0 D
R24 A 0 4.7k
R25 A 0 2.2k
R26 B 0 4.7k
R27 B 0 2.2k
V1 +5V 0 5
V2 B 0 5
V3 A 0 5
D23 N049 A 1N4001
D24 N049 B 1N4001
D25 N049 N050 1N4001
D26 N050 N051 1N4001
Q7 N045 N051 0 0 2N3904
V4 +5V 0 5
V5 B 0 5
V6 A 0 5
R48 A 0 1.5k
R49 B 0 1.5k
R28 +5V N045 3.9k
R29 +5V N049 15k
D27 N035 A 1N4001
D28 N035 N045 1N4001
D29 N035 N036 1N4001
D30 N036 N037 1N4001
Q8 N034 N037 0 0 2N3904
R30 +5V N034 3.9k
R31 +5V N035 15k
D31 N057 N045 1N4001
D32 N057 B 1N4001
D33 N057 N058 1N4001
D34 N058 N059 1N4001
Q9 N053 N059 0 0 2N3904
R32 +5V N053 3.9k
R33 +5V N057 15k
D35 N046 N034 1N4001
D36 N046 N053 1N4001
D37 N046 N047 1N4001
D38 N047 N048 1N4001
Q10 N030 N048 0 0 2N3904
R34 +5V N030 3.9k
R35 +5V N046 15k
D39 N042 N030 1N4001
D40 N042 C_IN 1N4001
D41 N042 N043 1N4001
D42 N043 N044 1N4001
Q11 N038 N044 0 0 2N3904
R36 +5V N038 3.9k
R37 +5V N042 15k
D43 N031 N030 1N4001
D44 N031 N038 1N4001
D45 N031 N032 1N4001
D46 N032 N033 1N4001
Q12 N029 N033 0 0 2N3904
R38 +5V N029 3.9k
R39 +5V N031 15k
D47 N054 N038 1N4001
D48 N054 C_IN 1N4001
D49 N054 N055 1N4001
D50 N055 N056 1N4001
Q13 N052 N056 0 0 2N3904
R40 +5V N052 3.9k
R41 +5V N054 15k
D51 N039 N029 1N4001
D52 N039 N052 1N4001
D53 N039 N040 1N4001
D54 N040 N041 1N4001
Q14 SUM N041 0 0 2N3904
R42 +5V SUM 3.9k
R43 +5V N039 15k
D55 N060 N038 1N4001
D56 N060 N045 1N4001
D57 N060 N061 1N4001
D58 N061 N062 1N4001
Q15 C_OUT N062 0 0 2N3904
R44 +5V C_OUT 3.9k
R45 +5V N060 15k
V7 C_IN 0 5
.model D D
.lib standard.dio
.model NPN NPN
.model PNP PNP
.lib standard.bjt
* Button
.backanno
.end